# Altium schematic sheet RFID Reader JTAG.SchDoc
size A3; SheetNumber: 7; SheetTotal: 8
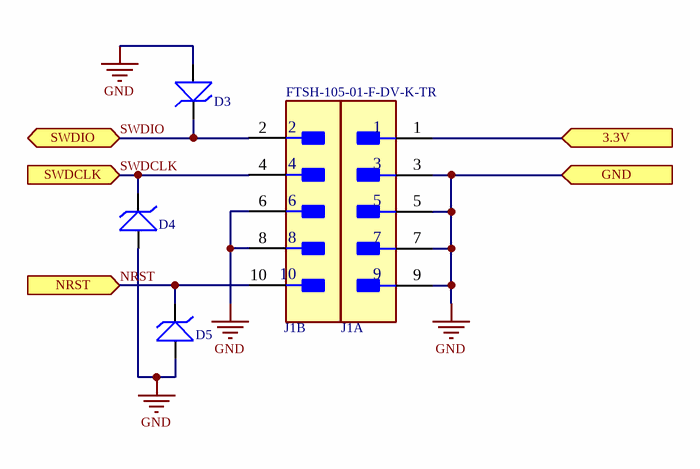
[diagram p0: RFID Reader JTAG.SchDoc]

## Parts
?  (no value)  (graphical)
D3  ESD351DPYR  [Texas Instruments DPY0002A]  (value not drawn)
D4  ESD351DPYR  [Texas Instruments DPY0002A]  (value not drawn)
D5  ESD351DPYR  [Texas Instruments DPY0002A]  (value not drawn)
J1  FTSH-105-01-F-DV-K-TR  [FP-FTSH-105-01-F-DV-K-TR-MFG]  (parts A,B of 2)

## Ports
3.3V (in), GND (in), NRST (in), SWDCLK (in), SWDIO (bidir)

## Nets
GND: D3.2(A) D4.2(A) D5.2(A) J1.3 J1.5 J1.6 J1.7 J1.8 J1.9 ; port GND
3.3V: J1.1 ; port 3.3V
NRST: D5.1(C) J1.10 ; port NRST
SWDCLK: D4.1(C) J1.4 ; port SWDCLK
SWDIO: D3.1(C) J1.2 ; port SWDIO

## Notes on the sheet
- LAYER NAME
- CRITICAL QUALITY ATTRIBUTE
- TITLE NAME
- THIS DRAWING CONTAINS CONFIDENTIAL INFORMATION AND IS ISSUED IN CONFIDENCE ON THE CONDITIONS
  THAT IT BE RETURNED ON DEMAND AND NOT BE COPIED, REPRODUCED, DISCLOSED TO OTHERS OR USED
  IN THE MANUFACTURE OF THE SUBJECT-MATTER THEREOF WITHOUT THE WRITTEN CONSENT OF
  STRYKER CORPORATION.
- SHALL BE COMPLIANT PER ES-1168 AND ES-1005
- SHEET
- OF
- NUMBER
- REV
- APPROVALS ARE FOUND IN PLM SYSTEM

## Library data of the parts
? = CMP-001-0000-v0.01.17: Stryker standard title block with pre-parameterized fields
D3-D5 = CMP-000238-v0.01.00: Trans Voltage Suppressor Diode, 36W, 3.6V V(RWM), Unidirectional, 1 Element, Silicon; Manufacturer: Texas Instruments; Channels - Bidirectional: 0; Channels - Unidirectional: 1; Capacitance @Frequency: 2.2pF; Voltage - Clamping (Max): 6.5V; Device Length: 1.1mm; Voltage - Breakdown (Max): 7.5V; Voltage - Breakdown (Min): 4.5V; Device Width: 700µm; Current - Reverse Leakage (Max): 10nA; Voltage - Instantaneous Forward (Max): 800mV; Capacitance Measurement Frequency: 1MHz; Current - Peak Pulse: 80A; Device Height: 450µm; Style Guide Revision: Librarian to Review; RoHS Compliant: Yes; Voltage - Reverse Standoff (Typ): 3.6V; Pin Count: 2; Operating Temperature - Max: 125°C; Manufacturer Part Number: ESD351DPYR; REACH Compliant: Unaffected; ComponentLink1URL: https://www.ti.com/product/ESD351/part-details/ESD351DPYR; Operating Temperature - Min: -40°C; Mounting Technology: SMT; Power - Peak Pulse: 36W; Critical Component: -; ComponentLink1Description: Manufacturer Link; Moisture Sensitivity Level: 1; Case/Package: X1SON
J1 = CMP-001-0013-v0.01.03: Board Connector, 10 Contact(s), 2 Row(s), Male, Straight, 0.05 inch Pitch, Surface Mount Terminal, Locking; Manufacturer: SAMTEC; Rows: 2; Max Current Rating: 3.4A; Body Length: 0.25inch; DIN Conformance: No; Mating Information: MULTIPLE MATING PARTS AVAILABLE; Contact Style: SQ PIN-SKT; Plating Thickness: 3uin; Reference Standard: UL; PCB Contact Pattern: RECTANGULAR; Number Of Connectors: 1; Option: General Purpose; Additional Feature: TAPE AND REEL; PCB Contact Row Spacing: 4.064mm; Number of Contacts: 10; Body Breadth: 0.135inch; Reliability: COMMERCIAL; Voltage Rating: 5V; Contact Gender: Male; RoHS Compliant: Yes; Contact Material: Bronze; Mounting Style: STRAIGHT; Connector Type: BOARD CONNECTOR; Mount: Board; Termination: SMD/SMT; Number Of PCB Rows: 2; Mounting Technology: smt; Pins: 10; MIL Conformance: No; IEC Conformance: No; Max Operating Temperature: 125°C; JESD-609 Code: e3; Mounting Option 1: LOCKING; Mixed Contacts: No; Contact Finish - Mating: GOLD FLASH OVER NICKEL (50); Mating Contact Row Spacing: 0.05inch; Number of Rows Loaded: 2; Manufacturer Part Number: FTSH-105-01-F-DV-K-TR; Contact Finish - Termination: Tin (Sn) - with Nickel (Ni) barrier; Reach SVHC Compliant: Yes; Terminal Pitch: 1.27mm; Filter Feature: No; Min Operating Temperature: -55°C; Contact Pattern: RECTANGULAR; Features: 10-Pin JTAG Header; Insulation Material: Polymer; Mating Contact Pitch: 0.05inch